# EAGLE design wallplug (EAGLE 7.4.0)
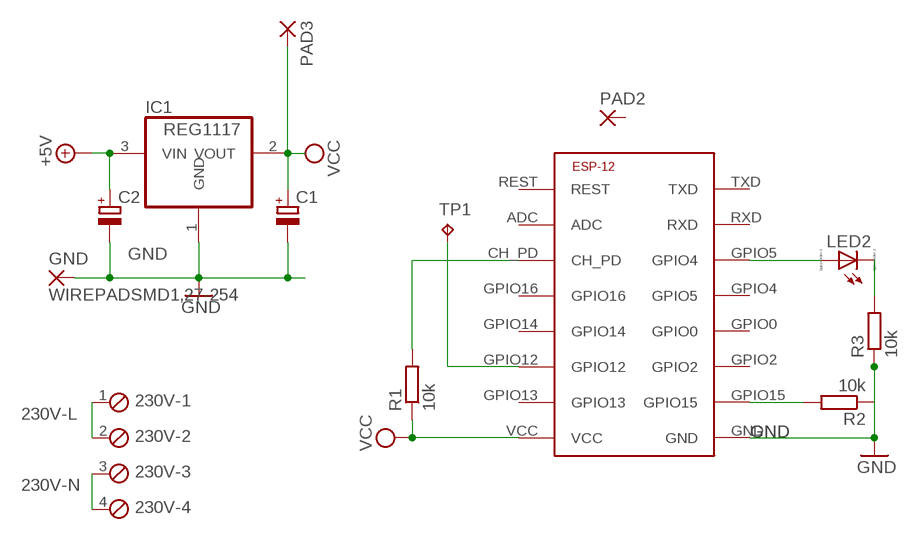
[diagram p0: schematic, sheet 1]

## Parts
230V  MPT4  [4POL254]
C1  CPOL-EUSMCC  [SMC_C]
C2  CPOL-EUSMCC  [SMC_C]
ESP1  ESP-12ESP-12  [ESP-12]
GND  WIREPADSMD1,27-254  [SMD1,27-2,54]
IC1  REG1117  [SOT223]
LED2  LED_ESML0603  [LED_SML0603]
PAD2  1,6/0,9  [1,6/0,9]
PAD3  SMD5  [SMD2,54-5,08]
R1  10k  R-EU_M0805  [M0805]
R2  10k  R-EU_M0805  [M0805]
R3  10k  R-EU_M0805  [M0805]
TP1  TPB1,27  [B1,27]

## Nets
230V-L: 230V.1 230V.2
230V-N: 230V.3 230V.4
+5V: C2.+ IC1.3(VIN)
GND: C1.- C2.- ESP1.GND GND.1(P) IC1.1(GND) R2.1 R3.1
N$1: ESP1.CH_PD R1.2
N$2: ESP1.GPIO12 TP1.TP
N$3: ESP1.GPIO15 R2.2
N$4: ESP1.GPIO5(GPIO4) LED2.A
N$5: LED2.C R3.2
VCC: C1.+ ESP1.VCC IC1.2(VOUT) PAD3.1(P) R1.1
Unconnected: ESP1.ADC ESP1.GPIO0 ESP1.GPIO2 ESP1.GPIO4(GPIO5) ESP1.GPIO13 ESP1.GPIO14 ESP1.GPIO16 ESP1.REST ESP1.RXD ESP1.TXD PAD2.1(P)

## Library data of the parts
230V = con-phoenix-254:MPT4: PHOENIX CONNECTOR; OC_FARNELL: unknown; OC_NEWARK: unknown
C1 C2 = resistor:CPOL-EU: POLARIZED CAPACITOR, European symbol; OC_FARNELL: unknown
ESP1 = ESP8266-ESP12:ESP-12: low cost Wifi to Serial Module
GND = wirepad:WIREPAD: Wire PAD connect wire on PCB
IC1 = burr-brown:REG1117: 800mA and 1A Low Dropout (LDO) Positive Regulator 1.8V, 2.5V, 2.85V, 3.3V, 5V, and Adj; MF: TEXAS INSTRUMENTS; MPN: REG1117; OC_FARNELL: 1097566; OC_NEWARK: 14P6981
LED2 = eagle-ltspice:LED_E: LED Source: http://www.osram.convergy.de Source: www.luxeon.com Source: www.kingbright.com; SPICEMODEL: NONE; SPICEPREFIX: D; SPICETYPE: diode
PAD2 = wirepad:1,6/0,9: THROUGH-HOLE PAD
PAD3 = wirepad:SMD5: SMD PAD
R1-R3 = resistor:R-EU_: RESISTOR, European symbol; MF: STMICROELECTRONICS; MPN: LD1117S33TR; OC_FARNELL: 1202826
TP1 = testpad:TP: Test pad

## Board
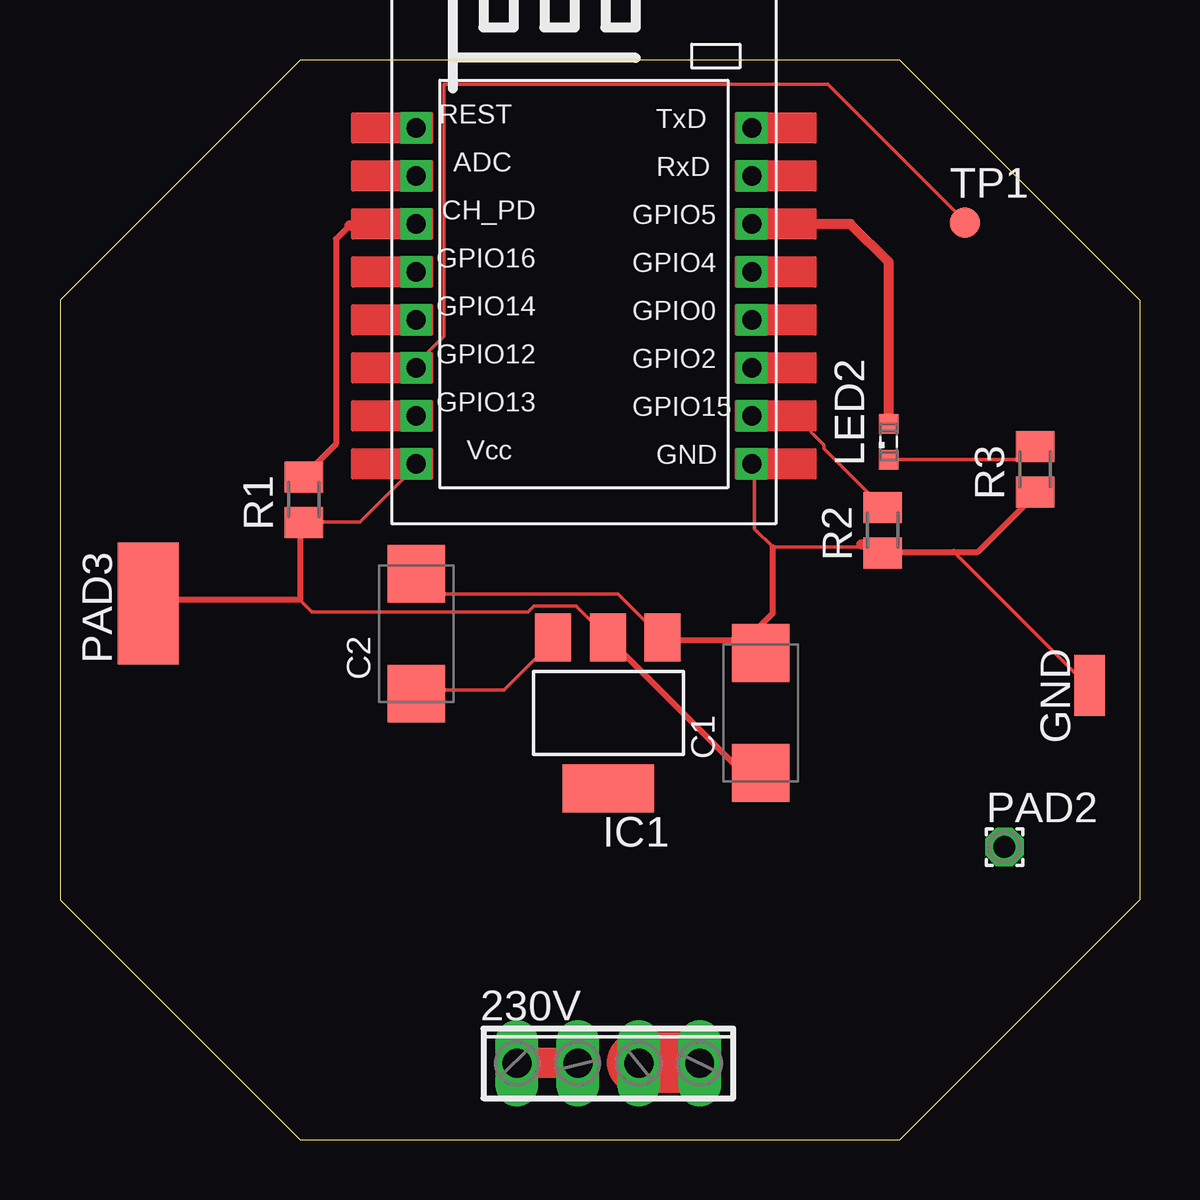
[diagram p1: board, top side]
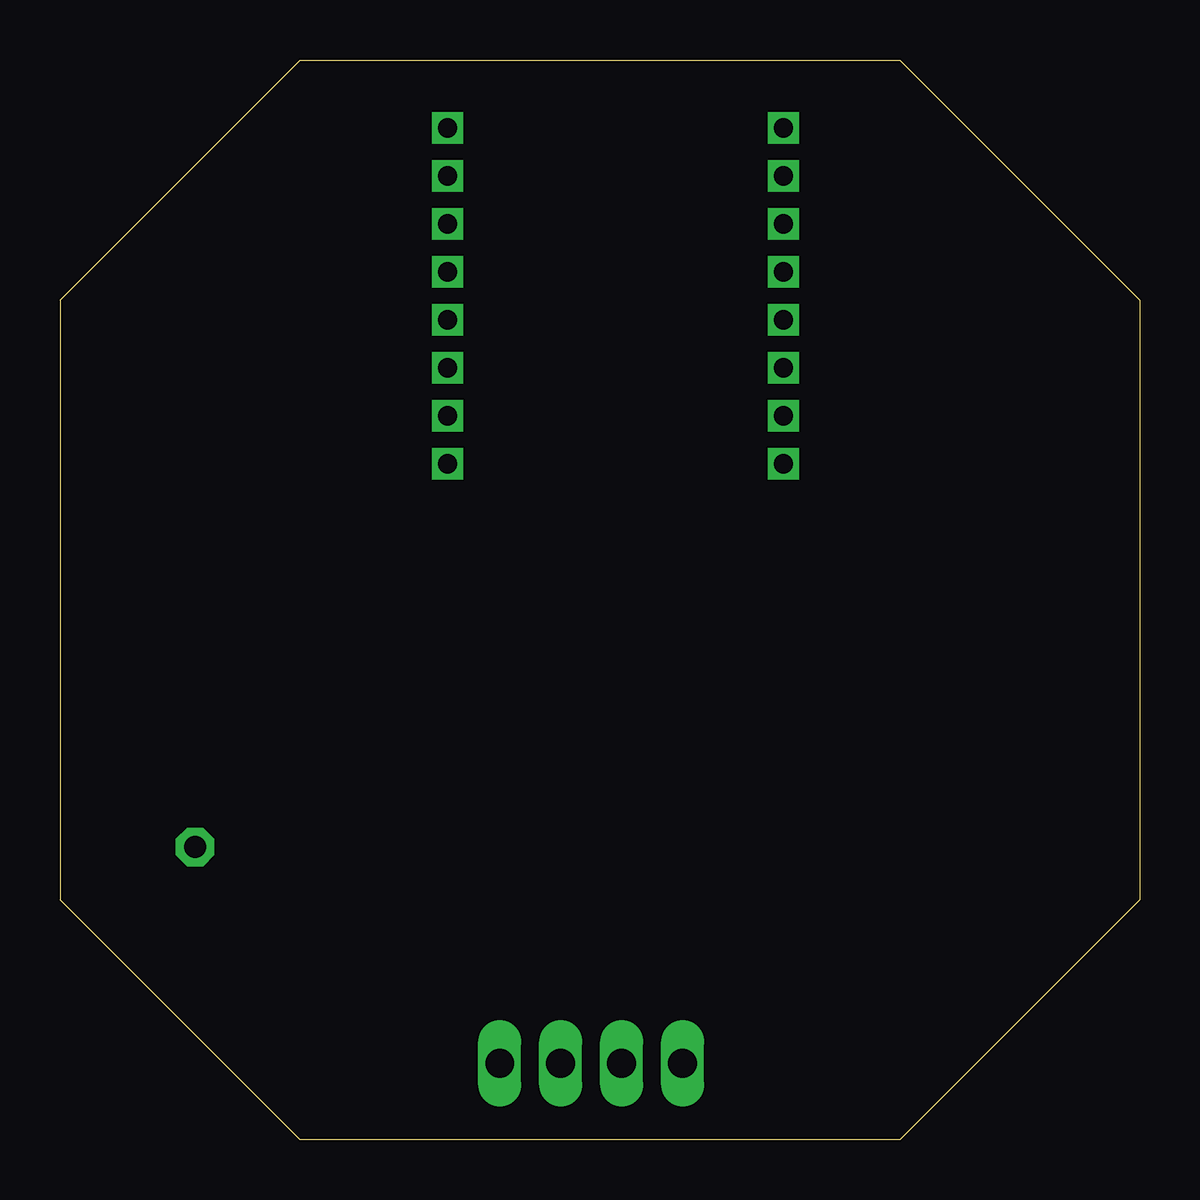
[diagram p2: board, bottom side, seen from below]

Size 45 x 45 mm. Coordinates in mm from the lower left corner, seen from the top.
Outline: 10,0 35,0 45,10 45,35 35,45 10,45 0,35 0,10 10,0
Copper layers (1*16): Top 0.035mm / dielectric 1.5mm / Bottom 0.035mm
Design rules "SeeedStudio_2layer_DRU_no_angle_20140221": minimum track width 6mil, minimum drill 12mil, track to track 6mil, track to pad 6mil, pad to pad 6mil, via to via 6mil, smd to smd 0mil, copper to edge 10mil, drill to drill 10mil, minimum pad ring 10mil, minimum via ring 6mil, stop-mask expansion 2mil, vias tented up to drill 100mil, thermal gap 10mil
tRestrict: area 7.6,0 to 11.4,6.3; area 33,0 to 35.6,6.3; area 7.6,6.3 to 35.6,7.6

### Footprints (pad centres in the part's own frame; a part is rotated, then mirrored left to right if it is on the bottom)
4POL254 = drill 1.2 long: 1 -3.81,0; 2 -1.27,0; 3 1.27,0; 4 3.81,0
SMC_C = smd 2.4 x 2.4: + -2.5,0; - 2.5,0
ESP-12 = drill 0.8 square: ADC 10,1; CH_PD 12,1; GND 22,15; GPIO0 16,15; GPIO2 18,15; GPIO4 14,15; GPIO5 12,15; GPIO12 18,1; GPIO13 20,1; GPIO14 16,1; GPIO15 20,15; GPIO16 14,1; REST 8,1; RXD 10,15; TXD 8,15; VCC 22,1
SMD1,27-2,54 = smd 1.27 x 2.54: 1 0,0
SOT223 = smd 1.499 x 2.007: 1 -2.261,-3.15; 2 0.025,-3.15; 3 2.311,-3.15 | smd 3.81 x 2.007: 4 0,3.15
LED_SML0603 = smd 0.8 x 0.8: A 0.75,0; C -0.75,0
1,6/0,9 = drill 0.914 pad 1.6 octagon: 1 0,0
SMD2,54-5,08 = smd 2.54 x 5.08: 1 0,0
M0805 = smd 1.3 x 1.6: 1 -0.95,0; 2 0.95,0
B1,27 = smd 1.27 x 1.27: TP 0,0

### Placement (x,y rotation side)
230V  22.86,3.17 0 top
C1  29.21,17.78 90 top
C2  14.86,21.08 90 top
ESP1  13.84,50.16 270 top
GND  42.93,18.92 0 top
IC1  22.86,17.78 180 top
LED2  34.54,29.08 90 top
PAD2  39.37,12.19 0 top
PAD3  3.68,22.35 0 top
R1  10.16,26.67 90 top
R2  34.29,25.4 90 top
R3  40.64,27.94 90 top
TP1  37.72,38.23 0 top

### Tracks (layer width: path | path; a pad name or v marks a point on that pad's centre or on a via)
230V-L  (via drill 0.6)
  Top 0.254: 21.57,3.2 230V.2
  Top 1.27: 21.57,3.2 v19.05,3.2
  Bottom 0.254: v19.05,3.2 230V.1
230V-N
  Top 0.254: 24.05,3.2 230V.3 | 26.34,3.2 230V.4
  Top 2.54: 26.34,3.2 24.05,3.2
+5V
  Top 0.152: IC1.3 20.5,20.75 18.5,18.75 15,18.75 C2.+
GND
  Top 0.152: ESP1.GND 28.96,28.04 28.96,25.45 29.72,24.69 33.38,24.69 33.42,24.81 | C2.- 15,23.5 15.75,22.75 23.25,22.75 25,21 IC1.1 | 37.25,24.5 42.75,19 GND.1
  Top 0.254: 28.57,20.8 25.15,20.8 IC1.1 | 28.57,20.8 29.03,20.34 C1.- 28.57,20.8 | 29.72,24.69 29.72,21.95 28.57,20.8 | R3.1 40.5,26.75 38.25,24.5 37.25,24.5 34.5,24.5 R2.1
  Top 0.406: R2.1 33.42,24.81 33.39,24.82
N$1
  Top 0.152: 10.5,28 R1.2 | 14.5,38 ESP1.CH_PD
  Top 0.254: 10.5,28 11.5,29 11.5,37.53 12.06,38.1
  Top 0.406: 12.06,38.1 14.78,38.1 ESP1.CH_PD
N$2
  Top 0.152: TP1.TP 37.5,38.5 32,44 16,44 16,33.5 15,32.5 ESP1.GPIO12
N$3
  Top 0.152: R2.2 34.29,26.36 31.85,28.8 31.85,28.96 30.79,30.02 28.96,30.02 ESP1.GPIO15
N$4
  Top 0.152: 34.5,30 LED2.A | 29,38 ESP1.GPIO5
  Top 0.406: 34.5,30 34.54,30 34.54,36.58 32.95,38.16 ESP1.GPIO5
N$5
  Top 0.152: LED2.C 34.59,28.35 40.08,28.35 40.54,28.8 R3.2
VCC
  Top 0.152: 14.94,28.04 ESP1.VCC 14.75,28 12.5,25.75 10.25,25.75 R1.1 | 22.5,20.5 IC1.2 22.75,21 21.5,22.25 19.75,22.25 19.5,22 10.5,22 10,22.5
  Top 0.254: 10.29,25.6 R1.1 10,25.5 10,22.5 3.75,22.5 PAD3.1 | IC1.2 23,20.75 28.25,15.5 29,15.5 C1.+